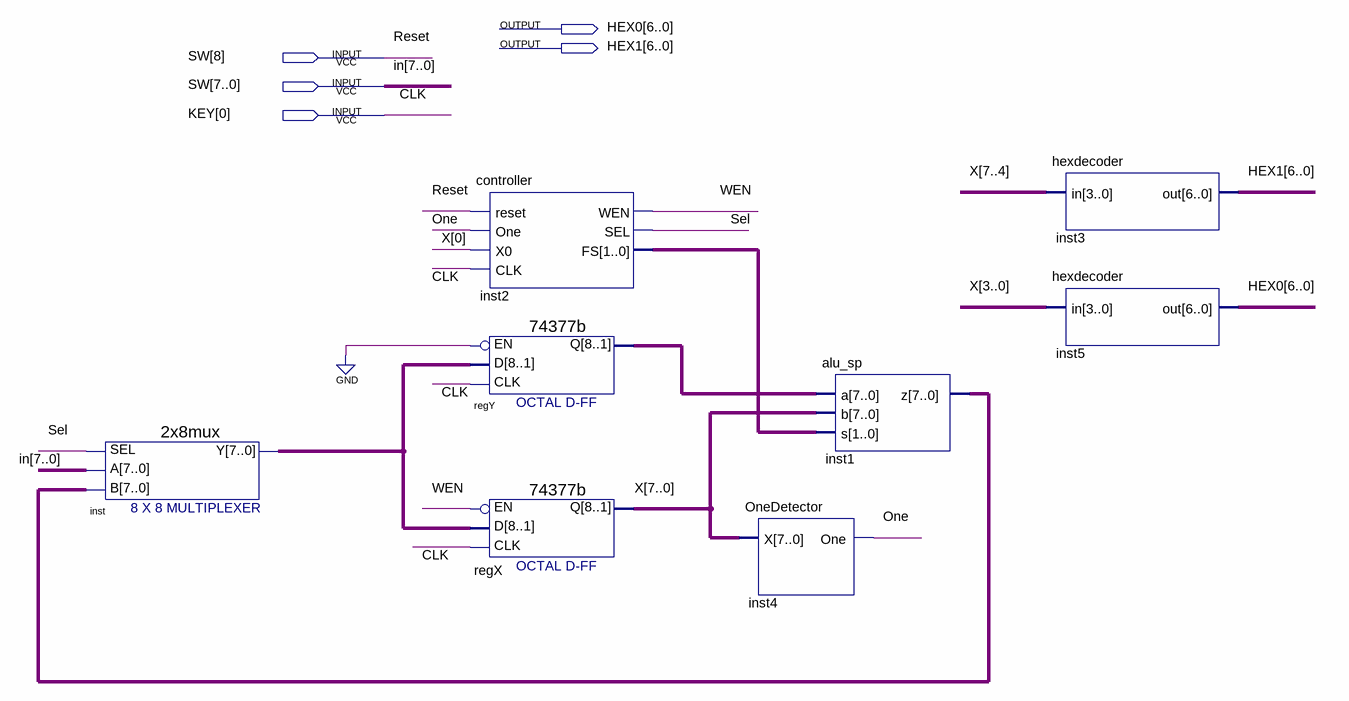
[diagram p0: schematic sheet]
// Quartus schematic Ulam.bdf as structural Verilog: 8 symbols, 5 pins
module Ulam (
  input  [8:0] SW,
  input  [0:0] KEY,
  output [6:0] HEX0,
  output [6:0] HEX1
);

  wire One, Sel, WEN;
  wire [1:0] inst2_fs;
  wire [7:0] inst1_z, inst_y, regY_q, X;

  \2x8mux  inst (.SEL(Sel), .A(SW[7:0]), .B(inst1_z), .Y(inst_y));
  controller inst2 (.reset(SW[8]), .One(One), .X0(X[0]), .CLK(KEY[0]), .WEN(WEN), .SEL(Sel), .FS(inst2_fs));
  \74377b  regY (.CLK(KEY[0]), .EN(1'b0), .D(inst_y), .Q(regY_q));
  \74377b  regX (.CLK(KEY[0]), .EN(WEN), .D(inst_y), .Q(X));
  OneDetector inst4 (.X(X), .One(One));
  alu_sp inst1 (.a(regY_q), .b(X), .s(inst2_fs), .z(inst1_z));
  hexdecoder inst3 (.in(X[7:4]), .out(HEX1));
  hexdecoder inst5 (.in(X[3:0]), .out(HEX0));

  // Other names for the same wires on the sheet: CLK = KEY[0]; in[7:0] = SW[7:0]; Reset = SW[8]
endmodule
